# Altium schematic sheet microcontroller.SchDoc: Microcontroller Unit
size A4; Author: Robocup; Organization: Hamburg Bit-Bots; Address1: Vogt-Kölln-Str. 30; Address2: 225257 Hamburg; Address3: Germany; Address4: www.bit-bots.de; DocumentNumber: 6; SheetNumber: 6; SheetTotal: 7; EMail: info@bit-bots.de
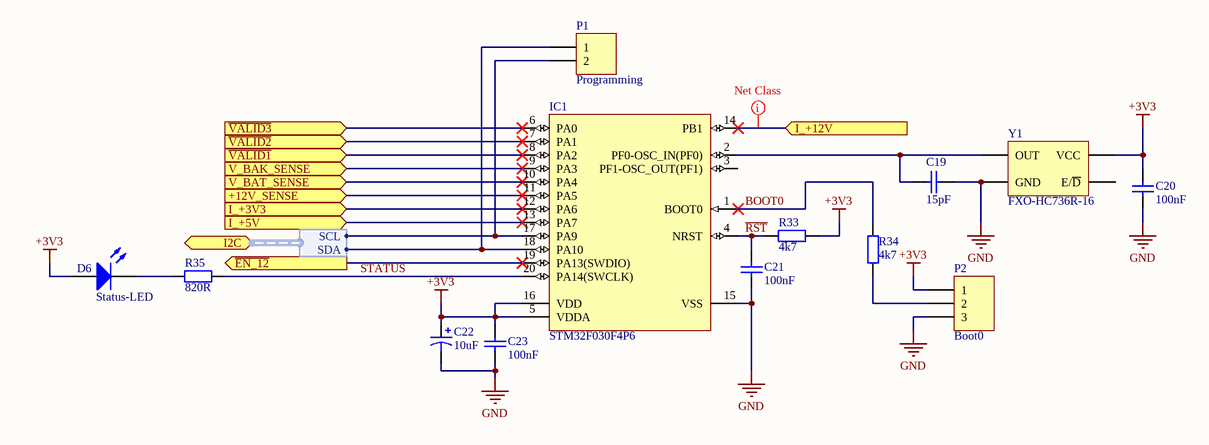
[diagram p0: microcontroller.SchDoc]

## Parts
C19  15pF  [C2012]
C20  100nF  [C2012]
C21  100nF  [C2012]
C22  10uF  [C2012]
C23  100nF  [C2012]
D6  Status-LED  [MLCC2]
IC1  STM32F030F4P6  [STM-TSSOP20_L]
P1  Programming  [HDR1X2]  (no BOM)
P2  Boot0  [HDR1X3]  (no BOM)
R33  4k7  [R2012]
R34  4k7  [R2012]
R35  820R  [R2012]
Y1  FXO-HC736R-16  [FXO-HC73]

## Ports
+12V_SENSE (in), I2C (harness I2C), I_+3V3 (in), I_+5V (in), I_+12V (in), V_BAK_SENSE (in), V_BAT_SENSE (in), ~{EN_12} (out), ~{VALID1} (in), ~{VALID2} (in), ~{VALID3} (in)

## Harnesses
I2C: SCL, SDA

## Nets
+3V3: C20.1 C22.1 C23.2 D6.1(A) IC1.5(VDDA) IC1.16(VDD) P2.1 R33.1 Y1.4(VCC)
GND: C19.1 C20.2 C21.1 C22.2 C23.1 IC1.15(VSS) P2.3 Y1.2(GND)
+12V_SENSE: IC1.11(PA5) ; port +12V_SENSE
~{EN_12}: IC1.19(PA13(SWDIO)) ; port ~{EN_12}
~{RST}: C21.2 IC1.4(NRST) R33.2
~{VALID1}: IC1.8(PA2) ; port ~{VALID1}
~{VALID2}: IC1.7(PA1) ; port ~{VALID2}
~{VALID3}: IC1.6(PA0) ; port ~{VALID3}
BOOT0: IC1.1(BOOT0) R34.1
I_+3V3: IC1.12(PA6) ; port I_+3V3
I_+5V: IC1.13(PA7) ; port I_+5V
I_+12V: IC1.14(PB1) ; port I_+12V
STATUS: IC1.20(PA14(SWCLK)) R35.2
V_BAK_SENSE: IC1.9(PA3) ; port V_BAK_SENSE
V_BAT_SENSE: IC1.10(PA4) ; port V_BAT_SENSE
NetC19_2: C19.2 IC1.2(PF0-OSC_IN(PF0)) Y1.3(OUT)
NetD6_2: D6.2(K) R35.1
NetIC1_17: IC1.17(PA9) P1.2 ; port I2C.SCL
NetIC1_18: IC1.18(PA10) P1.1 ; port I2C.SDA
NetP2_2: P2.2 R34.2

Not connected (* = marked no-connect by the designer): IC1 3(PF1-OSC_OUT(PF1)); Y1 1(E/~{D})

## Layout directives
net class Analog: I_+12V

## Notes on the sheet
- Project:
- Author:
- Title:
- Rev:
- Date:
- Time:
- Sheet
- of

## Library data of the parts
C19 = Cap: Capacitor; Manufacturer: MULTICOMP; Manufacturer Part Number: MC0805N150J500CT; Produktpalette: Baureihe MC; Kapazität: 15; Kapazitätstoleranz: ±5%; Dielektrikum: C0G / NP0; Nennspannung: 50; Keramikkondensatorgehäuse: 0805 [Metrisch 2012]; Betriebstemperatur, min.: -55; Betriebstemperatur, max.: 125; Verpackung: Gurtabschnitt; SVHC: No SVHC (17-Dec-2014); Betriebstemperatur: -55°C bis +125; Kondensatoranschlüsse: SMD<!--FANDB--><div class="features-and-benefits-container"></div>; Published: 8-Jun-2000; LatestRevisionDate: 17-Jul-2002; LatestRevisionNote: Re-released for DXP Platform.; PackageReference: RAD-0.3; Publisher: Altium Limited; PackageDescription: Radial Cap, Thru-Hole; 2 Leads; 0.3 in Pin Spacing; Value: 15pF; Supplier 1: Farnell; Supplier Part Number 1: 1759193; RoHS: YES; Stock 1: 38433; Pricing 1: 10=0,021, 100=0,017, 500=0,014, 1000=0,012, 2000=0,009 (EUR); MSL: -; Bauform: 0805 [Metrisch 2012]; Kapazitätstoleranz ±: ±5%; ComponentLink1URL: http://www.farnell.com/datasheets/1870456.pdf; ComponentLink1Description: http://www.farnell.com/datasheets/1870456.pdf
C20 C21 C23 = Cap: Capacitor; Published: 8-Jun-2000; LatestRevisionDate: 17-Jul-2002; LatestRevisionNote: Re-released for DXP Platform.; PackageReference: RAD-0.3; Publisher: Altium Limited; PackageDescription: Radial Cap, Thru-Hole; 2 Leads; 0.3 in Pin Spacing; Value: 100nF
  C20: Supplier 1: Farnell; Supplier Part Number 1: 1759265
C22 = Cap Pol1: Polarized Capacitor (Radial); Published: 8-Jun-2000; LatestRevisionDate: 17-Jul-2002; LatestRevisionNote: Re-released for DXP Platform.; PackageReference: RB7.6-15; Publisher: Altium Limited; PackageDescription: Polarized Capacitor (Radial); 2 Leads; Value: 10uF
D6 = LED0: Green; Published: 8-Jun-2000; LatestRevisionDate: 08-Jul-2005; LatestRevisionNote: Mech Layer 1 removed.; PackageReference: LED-0; Publisher: Altium Limited; PackageDescription: LED; 2 Leads
IC1 = CMP-0304-00039-2: ARM Cortex-M0 32-bit MCU, 16 KB Flash, 4 KB Internal RAM, 15 I/Os, 20-pin TSSOP, -40 to 85 degC, Tube; I/Os (High Current): 15; FLASH Size (Prog) (kB): 16; Internal RAM Size (kB): 4; Supply Voltage(Vcc) min (V): 2.4; Operating Frequency(F) (Processor speed) (MHz): 48; ComponentLink2URL: http://www.st.com/st-web-ui/static/active/en/resource/technical/document/datasheet/DM00088500.pdf; Core: ARM Cortex-M0; ComponentLink2Description: Datasheet; PackageDescription: 20-Pin Thin Shrink Small Outline Package, 6.5 x 4.4 mm Body, 0.65 mm Pitch; Mounting Technology: Surface Mount; ComponentLink1URL: http://www.st.com/web/en/home.html; PackageVersion: Rev. 1, 11/2012; ComponentLink3Description: Package Specification; PartNumber: STM32F030F4P6; ComponentLink3URL: http://www.st.com/st-web-ui/static/active/en/resource/technical/document/datasheet/DM00065136.pdf; DatasheetVersion: Rev. 1; PackageReference: TSSOP20; ComponentLink1Description: Manufacturer URL; Packing: Tube
P1 = Header 2: Header, 2-Pin; LatestRevisionDate: 17-Jul-2002; LatestRevisionNote: Re-released for DXP Platform.; Publisher: Altium Limited
P2 = Header 3: Header, 3-Pin; LatestRevisionDate: 17-Jul-2002; LatestRevisionNote: Re-released for DXP Platform.; Publisher: Altium Limited
R33-R35 = Res2: Resistor; Published: 8-Jun-2000; LatestRevisionDate: 17-Jul-2002; LatestRevisionNote: Re-released for DXP Platform.; PackageReference: AXIAL-0.4; Publisher: Altium Limited; PackageDescription: Axial Device, Thru-Hole; 2 Leads; 0.4 in Pin Spacing
  R33 R34: Value: 4k7
  R35: Value: 820R
Y1 = Oszillator: Oscillator with Enable Input; Supplier 1: Farnell; Supplier Part Number 1: 1640997